# Altium schematic sheet CH1-Input.SchDoc: CH1 INPUT
size A4; Author: MOG; CompanyName: GIE GROUP; DrawnBy: MOG; Organization: Gie SA; Address1: Galicia 52; Address2: Mar del Plata; Address3: Buenos Aires; Address4: Argentina; DocumentNumber: 2; Revision: 0.0; SheetNumber: 2; SheetTotal: 14; Project: CP DATALOGGER; PageSetup: Record=PageOptions|CenterHorizontal=True|CenterVertical=True|PrintScale=0.94|XCorrection=1.00|YCorrection=1.00|PrintKind=0|BorderSize=5000000|LeftOffset=0|BottomOffset=0|Orientation=2|PaperLength=1000|PaperWidth=1000|Scale=100|PaperSource=7|PrintQuality=720|MediaType=1|DitherType=10|PaperKind=A4|PrintScaleMode=1
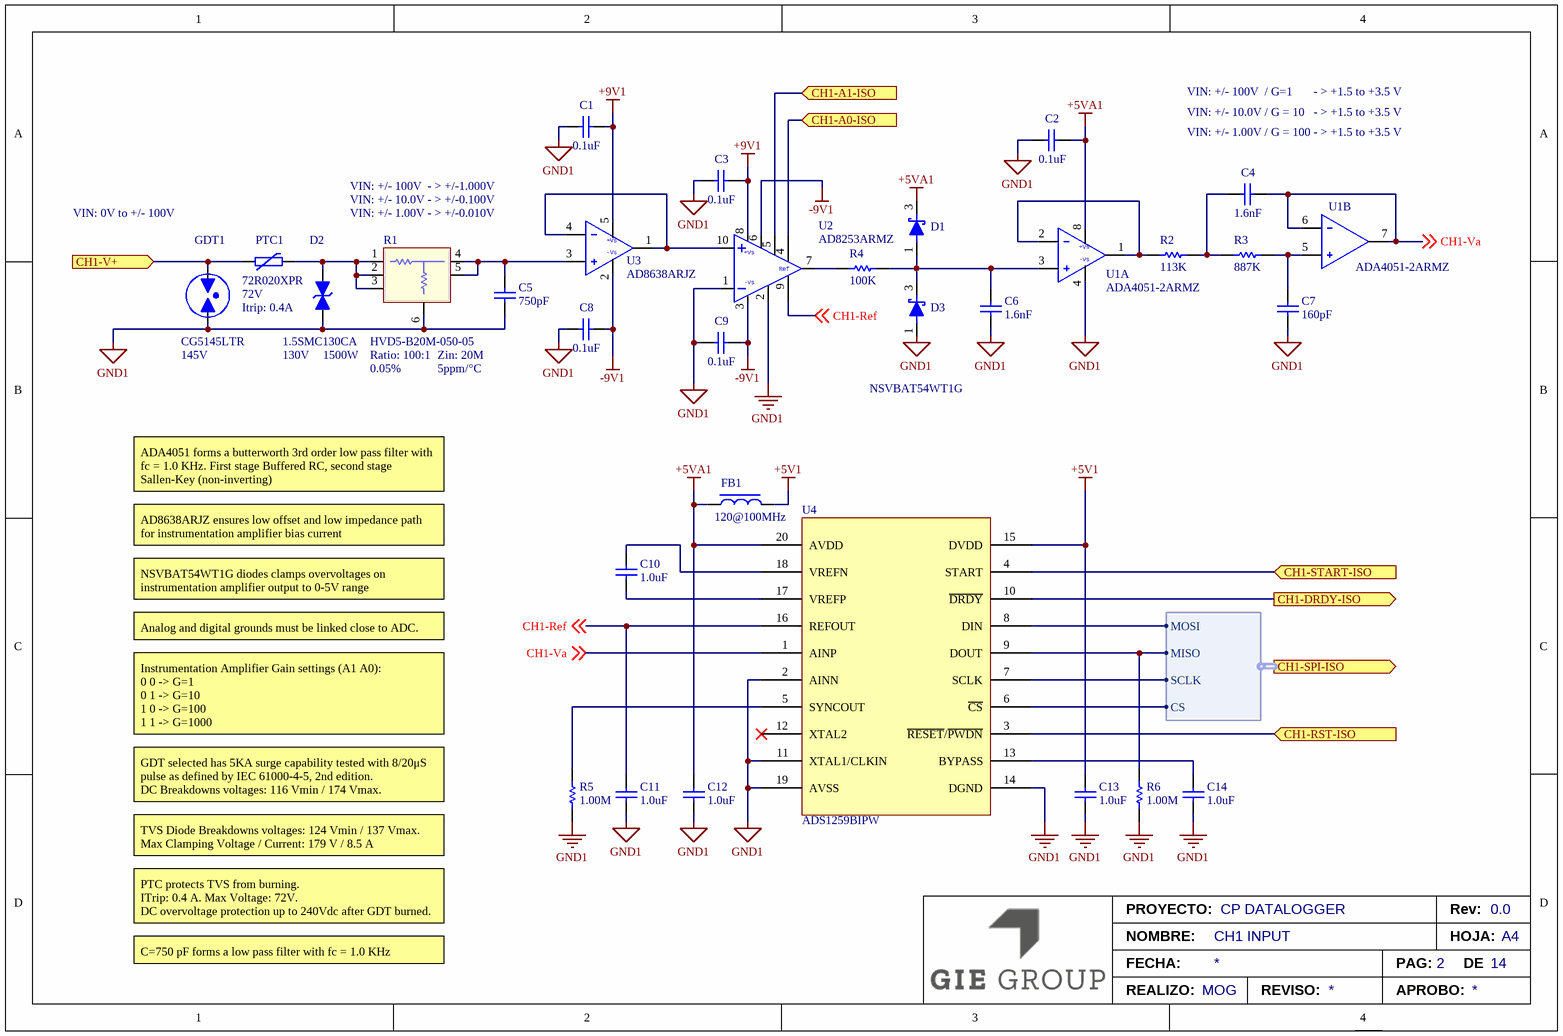
[diagram p0: CH1-Input.SchDoc]

## Parts
C1  value 0.1uF  [CAP-0603]  (hidden comment: C0603C104K5RACAUTO)
C2  value 0.1uF  [CAP-0603]  (hidden comment: C0603C104K5RACAUTO)
C3  value 0.1uF  [CAP-0603]  (hidden comment: C0603C104K5RACAUTO)
C4  value 1.6nF  [CAP-0603]  (hidden comment: C0603C162J5GAC7867)
C5  value 750pF  [CAP-0603]  (hidden comment: C0603C161J1GAC7867)
C6  value 1.6nF  [CAP-0603]  (hidden comment: C0603C162J5GAC7867)
C7  value 160pF  [CAP-0603]  (hidden comment: C0603C161J1GAC7867)
C8  value 0.1uF  [CAP-0603]  (hidden comment: C0603C104K5RACAUTO)
C9  value 0.1uF  [CAP-0603]  (hidden comment: C0603C104K5RACAUTO)
C10  value 1.0uF  [CAP-0603]  (hidden comment: C0603C105M3RAC7867)
C11  value 1.0uF  [CAP-0603]  (hidden comment: C0603C105M3RAC7867)
C12  value 1.0uF  [CAP-0603]  (hidden comment: C0603C105M3RAC7867)
C13  value 1.0uF  [CAP-0603]  (hidden comment: C0603C105M3RAC7867)
C14  value 1.0uF  [CAP-0603]  (hidden comment: C0603C105M3RAC7867)
D1  NSVBAT54WT1G  [SOT-323-3]  (value not drawn)
D2  Voltage: 130V  Power: 1500W  [SMC - BIIDIR]  (hidden comment: 1.5SMC130CA)
D3  NSVBAT54WT1G  [SOT-323-3]
FB1  value 120@100MHz  [IND-0603]  (hidden comment: Z0603C121GPWZT)
GDT1  Voltage: 145V  [LITTLELFUSE-CG5XXXLTR]  (hidden comment: CG5145LTR)
PTC1  Voltage: 72V  Itrip: 0.4A  [LITTLELFUSE-72R020X]  (hidden comment: 72R020XPR)
R1  Thermal: 5ppm/°C  Tolerance: 0.05%  Ratio: 100:1  Zin: 20M  [CADDOCK - HVD5-B20M-050-05]  (hidden comment: HVD5-B20M-050-05)
R2  value 113K  [RES-0603]  (hidden comment: RC0603FR-07113KL)
R3  value 887K  [RES-0603]  (hidden comment: RC0603FR-07887KL)
R4  value 100K  [RES-0603]  (hidden comment: RC0603FR-07100KL)
R5  value 1.00M  [RES-0603]  (hidden comment: RC0603FR-071ML)
R6  value 1.00M  [RES-0603]  (hidden comment: RC0603FR-071ML)
U1  ADA4051-2ARMZ  [MSOP8]  (parts A,B of 2)
U2  AD8253ARMZ  [MSOP10]
U3  AD8638ARJZ  [SOT23-5]
U4  ADS1259BIPW  [TSSOP20]

## Ports
CH1-A0-ISO (in), CH1-A1-ISO (in), CH1-DRDY-ISO (out), CH1-RST-ISO (in), CH1-SPI-ISO (out, harness CH1-SPI-ISO), CH1-START-ISO (in), CH1-V+ (in)

## Harnesses
CH1-SPI-ISO: MOSI, MISO, SCLK, CS

## Nets
+5V1: C13.2 FB1.2 U4.15(DVDD)
+5VA1: C2.2 C12.2 D1.3(K) FB1.1 U1.8(+VS) U4.20(AVDD)
+9V1: C1.2 C3.2 U2.8(+Vs) U3.5(+VS)
-9V1: C8.2 C9.2 U2.3(-Vs) U2.6(WR) U3.2(-Vs)
GND1: C1.1 C2.1 C3.1 C5.1 C6.1 C7.1 C8.1 C9.1 C11.1 C12.1 C13.1 C14.1 D2.2(K) D3.1(A) GDT1.2(K) R1.6 R5.1 R6.1 U1.4(-Vs) U2.1(-_IN) U2.2(DGND) U4.2(AINN) U4.11(XTAL1/CLKIN) U4.14(DGND) U4.19(AVSS)
CH1-A0-ISO: U2.4(A0) ; port CH1-A0-ISO
CH1-A1-ISO: U2.5(A1) ; port CH1-A1-ISO
CH1-DRDY-ISO: U4.10(~{DRDY}) ; port CH1-DRDY-ISO
CH1-Ref: C11.2 U2.9(REF) U4.16(REFOUT) ; off-sheet CH1-Ref
CH1-RST-ISO: U4.3(~{RESET}/~{PWDN}) ; port CH1-RST-ISO
CH1-START-ISO: U4.4(START) ; port CH1-START-ISO
CH1-V+: GDT1.1(A) PTC1.1 ; port CH1-V+
CH1-Va: C4.1 U1.6(-INB) U1.7(OUTB) U4.1(AINP) ; off-sheet CH1-Va
NetC4_2: C4.2 R2.2 R3.1
NetC5_2: C5.2 R1.4 R1.5 U3.3(+IN)
NetC6_2: C6.2 D1.1(A) D3.3(K) R4.2 U1.3(+INA)
NetC7_2: C7.2 R3.2 U1.5(+INB)
NetC10_1: C10.1 U4.17(VREFP)
NetC10_2: C10.2 U4.18(VREFN)
NetC14_2: C14.2 U4.13(BYPASS)
NetD2_1: D2.1(A) PTC1.2 R1.1 R1.2 R1.3
NetR2_1: R2.1 U1.1(OUTA) U1.2(-INA)
NetR4_1: R4.1 U2.7(OUT)
NetR5_2: R5.2 U4.5(SYNCOUT)
NetR6_2: R6.2 U4.9(DOUT) ; port CH1-SPI-ISO.MISO
NetU2_10: U2.10(+_IN) U3.1(OUT) U3.4(-IN)
NetU4_6: U4.6(~{CS}) ; port CH1-SPI-ISO.CS
NetU4_7: U4.7(SCLK) ; port CH1-SPI-ISO.SCLK
NetU4_8: U4.8(DIN) ; port CH1-SPI-ISO.MOSI

Not connected (* = marked no-connect by the designer): U4 12(XTAL2)*

## Notes on the sheet
- VIN: +/- 100V  / G=1       - > +1.5 to +3.5 V
- VIN: +/- 10.0V / G = 10   - > +1.5 to +3.5 V
- VIN: +/- 1.00V / G = 100 - > +1.5 to +3.5 V
- VIN: 0V to +/- 100V
- VIN: +/- 100V  - > +/-1.000V
- VIN: +/- 10.0V - > +/-0.100V
- (near R1) VIN: +/- 1.00V - > +/-0.010V
- ADA4051 forms a butterworth 3rd order low pass filter with fc = 1.0 KHz. First stage Buffered RC, second stage Sallen-Key (non-inverting)
- AD8638ARJZ ensures low offset and low impedance path for instrumentation amplifier bias current
- Analog and digital grounds must be linked close to ADC.
- NSVBAT54WT1G diodes clamps overvoltages on instrumentation amplifier output to 0-5V range
- Instrumentation Amplifier Gain settings (A1 A0):
  0 0 -> G=1
  0 1 -> G=10
  1 0 -> G=100
  1 1 -> G=1000
- GDT selected has 5KA surge capability tested with 8/20μS pulse as defined by IEC 61000-4-5, 2nd edition.
  DC Breakdowns voltages: 116 Vmin / 174 Vmax.
- TVS Diode Breakdowns voltages: 124 Vmin / 137 Vmax.
  Max Clamping Voltage / Current: 179 V / 8.5 A
- PTC protects TVS from burning.
  ITrip: 0.4 A. Max Voltage: 72V.
  DC overvoltage protection up to 240Vdc after GDT burned.
- C=750 pF forms a low pass filter with fc = 1.0 KHz
- PROYECTO:
- Rev:
- NOMBRE:
- FECHA:
- REALIZO:
- REVISO:
- APROBO:
- PAG:
- HOJA:
- DE
- A4
- (in symbol AD8253ARMZ) Ref
- (in symbol AD8638ARJZ) +Vs
- (in symbol ADA4051-2ARMZ, part A) +Vs

## Library data of the parts
C1-C3 C8 C9 = C0603C104K5RACAUTO: CAP CER 0.1uF 50V X7R 0603; Manufacturer: Kemet; Tolerance: 10%; Voltage: 50; PartNumber: C0603C104K5RACAUTO; Supplier 1: Digi-Key; Supplier 2: Mouser; Supplier Part Number 1: 399-6856-1-ND; Supplier Part Number 2: 80-C0603C104K5RAUTO
C4 C6 = C0603C162J5GAC7867: CAP CER 1600´pF 50V C0G 0603; Manufacturer: Kemet; Tolerance: 5%; Voltage: 50; PartNumber: C0603C162J5GAC7867; Supplier 1: Digi-Key; Supplier 2: Mouser; Supplier Part Number 1: 399-15368-1-ND; Supplier Part Number 2: 80-C0603C162J5G
C5 = C0603C751J5GAC7867: CAP CER 750´pF 50V C0G 0603; Manufacturer: Kemet; Tolerance: 5%; PartNumber: C0603C161J1GAC7867; Voltage: 50V; Supplier 1: Digi-Key; Supplier 2: Mouser; Supplier Part Number 1: 399-C0603C751J5GAC7867CT-ND; Supplier Part Number 2: 80-C0603C751J5G
C7 = C0603C161J1GAC7867: CAP CER 160 pF 100V C0G 0603; Manufacturer: Kemet; Tolerance: 5%; PartNumber: C0603C161J1GAC7867; Voltage: 100V; Supplier 1: Digi-Key; Supplier Part Number 1: 399-15367-1-ND
C10-C14 = C0603C105M3RAC7867: CAP CER 1uF 25V X7R 0603; Manufacturer: Kemet; Tolerance: 20%; Voltage: 25; PartNumber: C0603C105M3RAC7867; Supplier 1: Digi-Key; Supplier 2: Mouser; Supplier Part Number 1: 399-C0603C105M3RAC7867CT-ND; Supplier Part Number 2: 80-C0603C105M3R
D1 D3 = NSVBAT54WT1G: Schottky Diode 30V 200mA SOT323; Manufacturer: OnSemiconductor; IF(avg): 0.2A; VR(rms): 30V; Supplier 1: Digi-Key; Supplier 2: Mouser; Supplier Part Number 1: NSVBAT54WT1GOSDKR-ND; Supplier Part Number 2: 863-NSVBAT54WT1G; PartNumber: NSVBAT54WT1G
D2 = 1.5SMC130CA: TVS Diode 1.5kW 130V 5% Bi-Directional; Manufacturer: Littelfuse; Supplier 1: Digi-Key; Supplier 2: Mouser; Supplier Part Number 1: 1.5SMC130CACT-ND; Supplier Part Number 2: 576-1.5SMC130CA; PartNumber: 1.5SMC130CA
FB1 = Z0603C121GPWZT: Ferrite Bead 120Ohms 900mA 25% DCR=130m; Manufacturer: Kemet; PartNumber: Z0603C121GPWZT; Supplier 1: Digi-Key; Supplier 2: Mouser; Supplier Part Number 1: 399-Z0603C121GPWZTCT-ND; Supplier Part Number 2: 80-Z0603C121GPWZT
GDT1 = CG5145LTR: Gas Discharge Tube 145V; Manufacturer: Littelfuse; Supplier 1: Digi-Key; Supplier 2: Mouser; Supplier Part Number 1: CG5145LTR-ND; Supplier Part Number 2: 576-CG5145LTR; PartNumber: CG5145LTR
PTC1 = 72R020XPR: PTC Polyfuse Radial 72V 0.2A; Manufacturer: Littlelfuse; Ihold: 0.2A; Supplier 1: Digi-Key; Supplier 2: Mouser; Supplier Part Number 1: 72R020XPRCT-ND; Supplier Part Number 2: 576-72R020XPR; PartNumber: 72R020XPR
R1 = HVD5-B20M-050-05: 20M ohm 0.05% 5ppm Voltage Divider; Manufacturer: Caddock; Supplier 1: Digi-Key; Supplier 2: Mouser; Supplier Part Number 1: HVD5-B20M-050-05-ND; Supplier Part Number 2: 684-HVD5-B20M; PartNumber: HVD5-B20M-050-05
R2 = RC0603FR-07113KL: RES SMD 113K OHM 1% 1/10W 0603; Manufacturer: Yageo; Power: 0.1W; Tolerance: 1%; PartNumber: RC0603FR-07113KL; Supplier 1: Digi-Key; Supplier 2: Mouser; Supplier Part Number 2: 603-RC0603FR-07113KL; Supplier Part Number 1: 311-113KHRCT-ND
R3 = RC0603FR-07887KL: RES SMD 887K OHM 1% 1/10W 0603; Manufacturer: Yageo; Power: 0.1W; Tolerance: 1%; PartNumber: RC0603FR-07887KL; Supplier 1: Digi-Key; Supplier 2: Mouser; Supplier Part Number 1: 311-887KHRCT-ND; Supplier Part Number 2: 603-RC0603FR-07887KL
R4 = RC0603FR-07100KL: RES SMD 100K OHM 1% 1/10W 0603; Manufacturer: Yageo; Power: 0.1W; Tolerance: 1%; PartNumber: RC0603FR-07100KL; Supplier 1: Digi-Key; Supplier 2: Mouser; Supplier Part Number 1: 311-100KHRCT-ND; Supplier Part Number 2: 603-RC0603FR-07100KL
R5 R6 = RC0603FR-071ML: RES SMD 1M OHM 1% 1/10W 0603; Manufacturer: Yageo; Power: 0.1W; Tolerance: 1%; PartNumber: RC0603FR-071ML; Supplier 1: Digi-Key; Supplier 2: Mouser; Supplier Part Number 1: 311-887KHRCT-ND; Supplier Part Number 2: 603-RC0603FR-07887KL
U1 = ADA4051-2ARMZ: Dual  Precision Amplifier Micro Power Auto Zero; Manufacturer: Analog Devices; Supplier 1: Digi-Key; Supplier 2: Mouser; Supplier Part Number 1: 505-ADA4051-2ARMZ-ND; Supplier Part Number 2: 584-ADA4051-2ARMZ; PartNumber: ADA4051-2ARMZ
U2 = AD8253ARMZ: Instrumentation Amplifiers High Speed Programmable High Gain In-Amp; Manufacturer: Analog Devices Inc; PartNumber: AD8253ARMZ; Supplier 1: Digi-Key; Supplier 2: Mouser; Supplier Part Number 1: 505-AD8253ARMZ-R7DKR-ND; Supplier Part Number 2: 584-AD8253ARMZ-R7
U3 = AD8638ARJZ: 16V Auto-Zero CMOS Amplifier; Manufacturer: Analog Devices; Supplier 1: Digi-Key; Supplier 2: Mouser; Supplier Part Number 1: 505-AD8638ARJZ-REEL7DKR-ND; Supplier Part Number 2: 584-AD8638ARJZ-R7; PartNumber: AD8638ARJZ
U4 = ADS1259BIPW: Analog to Digital Converter 14.4kSPS 24-Bit; Manufacturer: Texas Instruments; Supplier 1: Digi-Key; Supplier 2: Mouser; Supplier Part Number 1: 296-27183-5-ND; Supplier Part Number 2: 595-ADS1259BIPW; PartNumber: ADS1259BIPW